# EAGLE design full_adder (EAGLE 9.6.0)

## Sheet 1 of 2
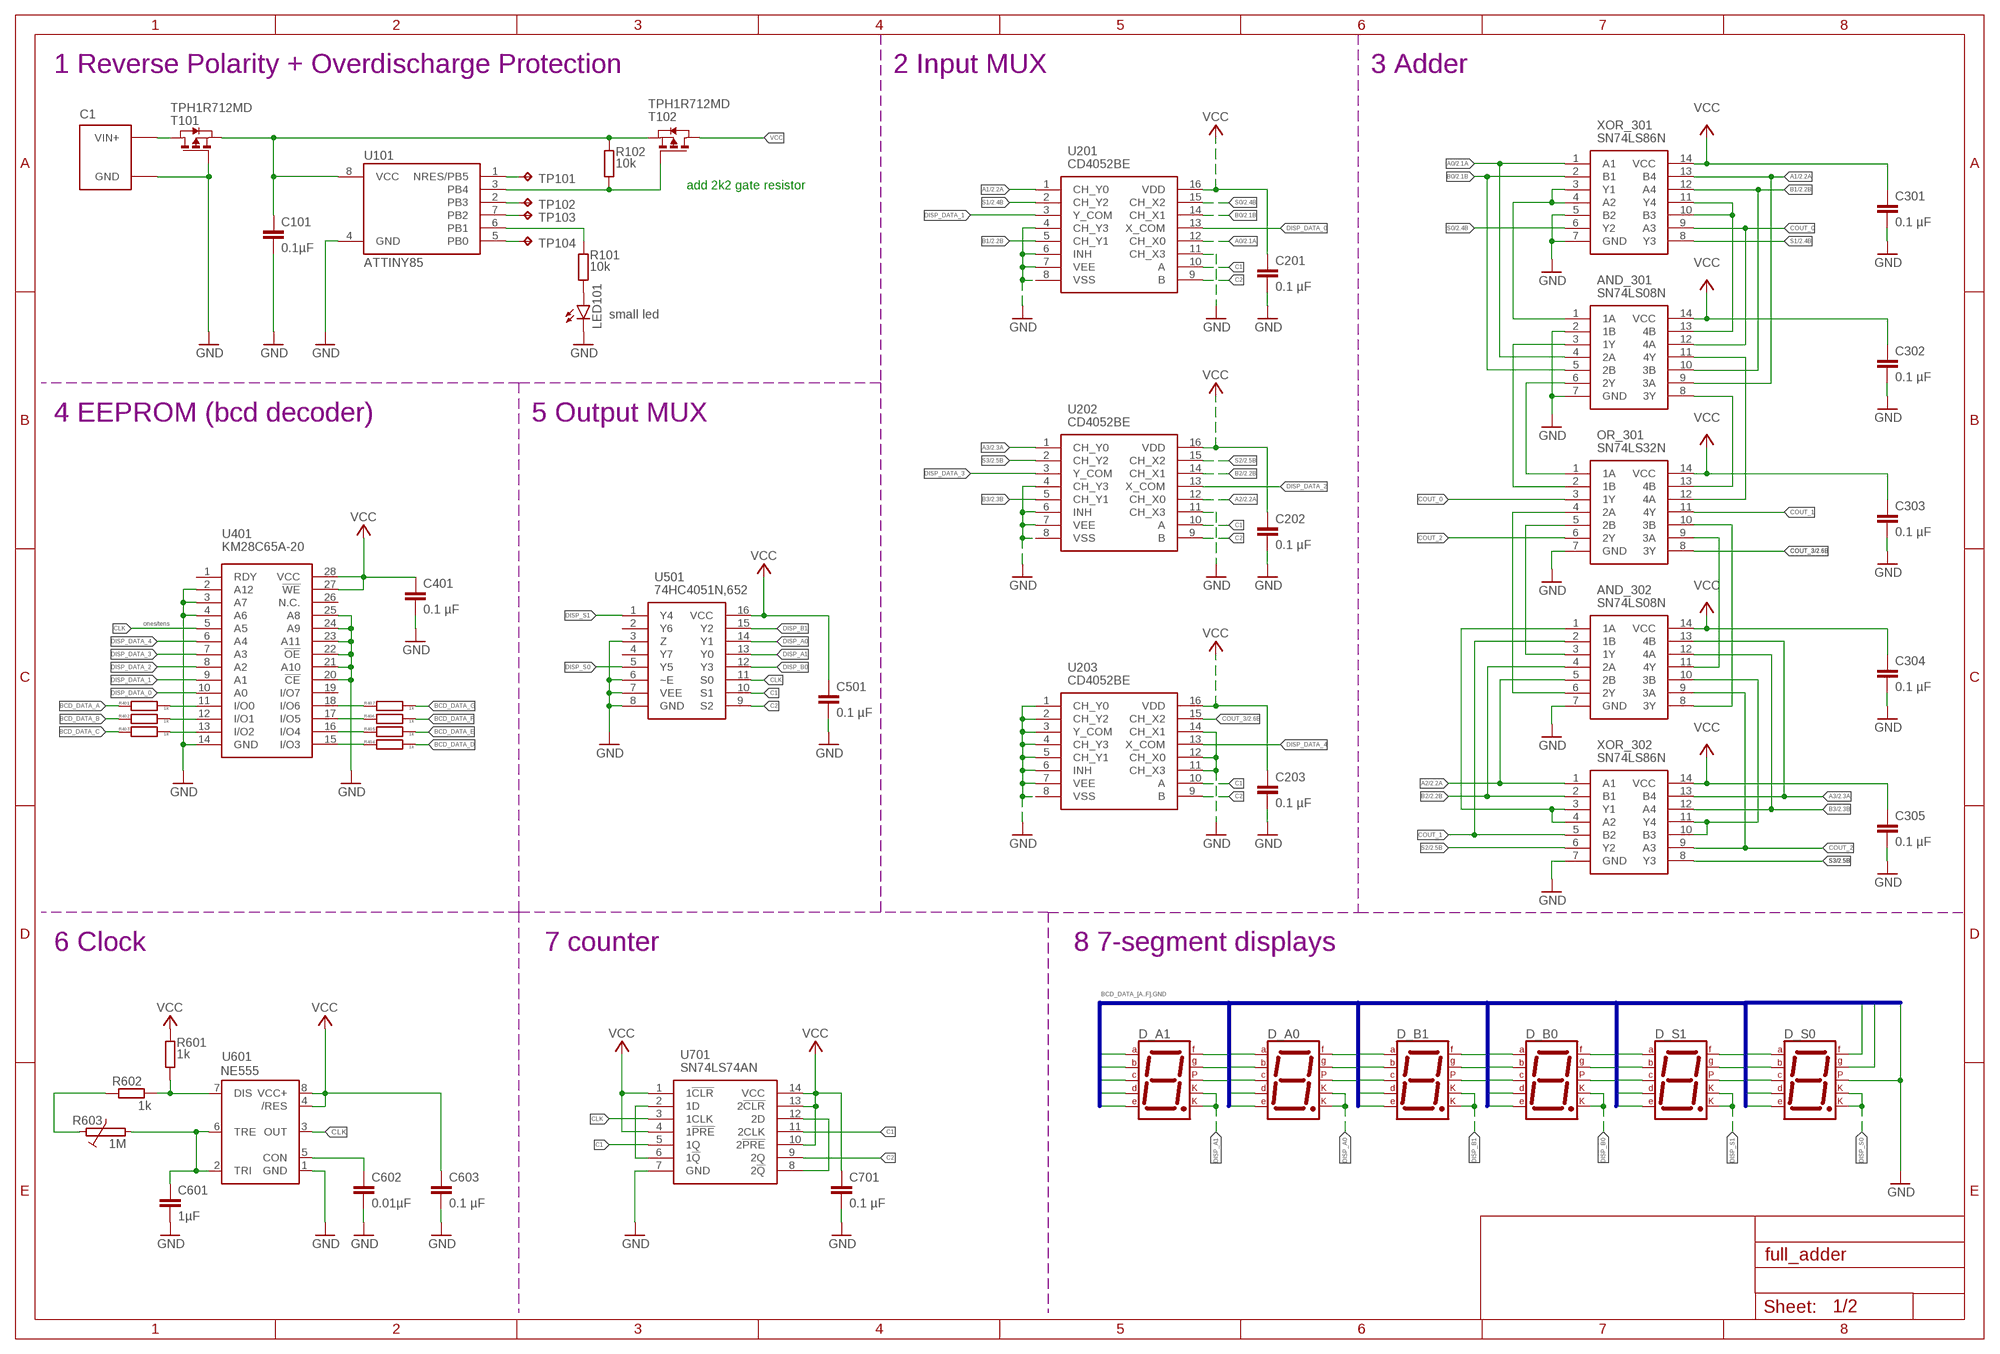
[diagram p0: schematic, sheet 1]

### Parts
AND_301  SN74LS08N  [DIP794W53P254L1930H508Q14N]
AND_302  SN74LS08N  [DIP794W53P254L1930H508Q14N]
C1  BATTERY_CONNECTOR  [BATTERY_CONNECTOR]
C101  0.1µF  C-EUC1206  [C1206]
C201  0.1 µF  C-EUC1206  [C1206]
C202  0.1 µF  C-EUC1206  [C1206]
C203  0.1 µF  C-EUC1206  [C1206]
C301  0.1 µF  C-EUC1206  [C1206]
C302  0.1 µF  C-EUC1206  [C1206]
C303  0.1 µF  C-EUC1206  [C1206]
C304  0.1 µF  C-EUC1206  [C1206]
C305  0.1 µF  C-EUC1206  [C1206]
C401  0.1 µF  C-EUC1206  [C1206]
C501  0.1 µF  C-EUC1206  [C1206]
C601  1µF  C-EU050-024X044  [C050-024X044]
C602  0.01µF  C-EU050-024X044  [C050-024X044]
C603  0.1 µF  C-EUC1206  [C1206]
C701  0.1 µF  C-EUC1206  [C1206]
D_A0  7SEG-CK  [7SEG-13]
D_A1  7SEG-CK  [7SEG-13]
D_B0  7SEG-CK  [7SEG-13]
D_B1  7SEG-CK  [7SEG-13]
D_S0  7SEG-CK  [7SEG-13]
D_S1  7SEG-CK  [7SEG-13]
LED101  LED3MM  [LED3MM]
OR_301  SN74LS32N  [DIP794W53P254L1930H508Q14N]
R101  10k  R-EU_R1206  [R1206]
R102  10k  R-EU_R1206  [R1206]
R401  1k  R-EU_R1206  [R1206]
R402  1k  R-EU_R1206  [R1206]
R403  1k  R-EU_R1206  [R1206]
R404  1k  R-EU_R1206  [R1206]
R405  1k  R-EU_R1206  [R1206]
R406  1k  R-EU_R1206  [R1206]
R407  1k  R-EU_R1206  [R1206]
R601  1k  R-EU_R1206  [R1206]
R602  1k  R-EU_R1206  [R1206]
R603  1M  POTENTIOMETER  [POTENTIOMETER]
T101  TPH1R712MD  [TPH1R712MDL1Q]
T102  TPH1R712MD  [TPH1R712MDL1Q]
TP101  TPB2,54  [B2,54]
TP102  TPB2,54  [B2,54]
TP103  TPB2,54  [B2,54]
TP104  TPB2,54  [B2,54]
U101  ATTINY85  ATTINY45-20P  [PDIP08_300MIL]
U201  CD4052BE  [DIP794W53P254L1930H508Q16N]
U202  CD4052BE  [DIP794W53P254L1930H508Q16N]
U203  CD4052BE  [DIP794W53P254L1930H508Q16N]
U401  KM28C65A-20  [KM28C65A-20]
U501  74HC4051N,652  [DIP254P762X420-16]
U601  NE555  [DIL-08]
U701  SN74LS74AN  [DIP794W53P254L1930H508Q14N]
XOR_301  SN74LS86N  [DIP762W53P254L1848H469Q14N]
XOR_302  SN74LS86N  [DIP762W53P254L1848H469Q14N]

### Nets
A0: AND_301.4(2A) U201.12(CH_X0) XOR_301.1(A1) ; also sheet 2
A1: AND_301.9(3A) U201.1(CH_Y0) XOR_301.13(B4) ; also sheet 2
A2: AND_302.5(2B) U202.12(CH_X0) XOR_302.1(A1) ; also sheet 2
A3: AND_302.13(4B) U202.1(CH_Y0) XOR_302.13(B4) ; also sheet 2
B0: AND_301.5(2B) U201.14(CH_X1) XOR_301.2(B1) ; also sheet 2
B1: AND_301.10(3B) U201.5(CH_Y1) XOR_301.12(A4) ; also sheet 2
B2: AND_302.4(2A) U202.14(CH_X1) XOR_302.2(B1) ; also sheet 2
B3: AND_302.12(4A) U202.5(CH_Y1) XOR_302.12(A4) ; also sheet 2
BCD_DATA_A: D_A0.7(A) D_A1.7(A) D_B0.7(A) D_B1.7(A) D_S0.7(A) D_S1.7(A) R401.1
BCD_DATA_B: D_A0.6(B) D_A1.6(B) D_B0.6(B) D_B1.6(B) D_S0.6(B) D_S1.6(B) R402.1
BCD_DATA_C: D_A0.4(C) D_A1.4(C) D_B0.4(C) D_B1.4(C) D_S0.4(C) D_S1.4(C) R403.1
BCD_DATA_D: D_A0.2(D) D_A1.2(D) D_B0.2(D) D_B1.2(D) D_S0.2(D) D_S1.2(D) R404.2
BCD_DATA_E: D_A0.1(E) D_A1.1(E) D_B0.1(E) D_B1.1(E) D_S0.1(E) D_S1.1(E) R405.2
BCD_DATA_F: D_A0.9(F) D_A1.9(F) D_B0.9(F) D_B1.9(F) D_S0.9(F) D_S1.9(F) R406.2
BCD_DATA_G: D_A0.10(G) D_A1.10(G) D_B0.10(G) D_B1.10(G) D_S0.10(G) D_S1.10(G) R407.2
C1: U201.10(A) U202.10(A) U203.10(A) U501.10(S1) U701.5(1Q) U701.11(2CLK)
C2: U201.9(B) U202.9(B) U203.9(B) U501.9(S2) U701.9(2Q)
CLK: U401.5(A5) U501.11(S0) U601.3(OUT) U701.3(1CLK)
COUT_0: AND_301.12(4A) OR_301.3(1Y) XOR_301.9(A3)
COUT_1: AND_302.2(1B) OR_301.11(4Y) XOR_302.5(B2)
COUT_2: AND_302.9(3A) OR_301.6(2Y) XOR_302.9(A3)
COUT_3: OR_301.8(3Y) U203.15(CH_X2) ; also sheet 2
DISP_A0: D_A0.3(CK1) D_A0.8(CK2) U501.14(Y1)
DISP_A1: D_A1.3(CK1) D_A1.8(CK2) U501.13(Y0)
DISP_B0: D_B0.3(CK1) D_B0.8(CK2) U501.12(Y3)
DISP_B1: D_B1.3(CK1) D_B1.8(CK2) U501.15(Y2)
DISP_DATA_0: U201.13(X_COM) U401.10(A0)
DISP_DATA_1: U201.3(Y_COM) U401.9(A1)
DISP_DATA_2: U202.13(X_COM) U401.8(A2)
DISP_DATA_3: U202.3(Y_COM) U401.7(A3)
DISP_DATA_4: U203.13(X_COM) U401.6(A4)
DISP_S0: D_S0.3(CK1) D_S0.8(CK2) U501.5(Y5)
DISP_S1: D_S1.3(CK1) D_S1.8(CK2) U501.1(Y4)
GND: AND_301.2(1B) AND_301.7(GND) AND_302.7(GND) C1.GND C101.2 C201.2 C202.2 C203.2 C301.2 C302.2 C303.2 C304.2 C305.2 C401.2 C501.2 C601.2 C602.2 C603.2 C701.2 D_A0.5(DP) D_A1.5(DP) D_B0.5(DP) D_B1.5(DP) D_S0.5(DP) D_S1.5(DP) LED101.K(C) OR_301.7(GND) T101.4(G) U101.4(GND) U201.4(CH_Y3) U201.6(INH) U201.7(VEE) U201.8(VSS) U201.11(CH_X3) U202.4(CH_Y3) U202.6(INH) U202.7(VEE) U202.8(VSS) U202.11(CH_X3) U203.1(CH_Y0) U203.2(CH_Y2) U203.3(Y_COM) U203.4(CH_Y3) U203.5(CH_Y1) U203.6(INH) U203.7(VEE) U203.8(VSS) U203.11(CH_X3) U203.12(CH_X0) U203.14(CH_X1) U401.2(A12) U401.3(A7) U401.4(A6) U401.14(GND) U401.20(!CE) U401.21(A10) U401.22(!OE) U401.23(A11) U401.24(A9) U401.25(A8) U501.3(Z) U501.6(~E) U501.7(VEE) U501.8(GND) U601.1(GND) U701.7(GND) XOR_301.5(B2) XOR_301.7(GND) XOR_302.7(GND) ; also sheet 2
N$1: AND_301.1(1A) XOR_301.3(Y1) XOR_301.4(A2)
N$2: AND_301.6(2Y) OR_301.1(1A)
N$3: AND_301.3(1Y) OR_301.2(1B)
N$4: AND_301.13(4B) XOR_301.10(B3) XOR_301.11(Y4)
N$5: AND_301.8(3Y) OR_301.13(4B)
N$6: AND_301.11(4Y) OR_301.12(4A)
N$7: AND_302.1(1A) XOR_302.3(Y1) XOR_302.4(A2)
N$8: AND_302.3(1Y) OR_301.5(2B)
N$9: AND_302.6(2Y) OR_301.4(2A)
N$10: AND_302.10(3B) XOR_302.10(B3) XOR_302.11(Y4)
N$11: C602.1 U601.5(CON)
N$12: AND_302.11(4Y) OR_301.9(3A)
N$13: AND_302.8(3Y) OR_301.10(3B)
N$14: C601.1 R603.POT$2 U601.2(TRI) U601.6(TRE)
N$15: R602.1 R603.POT$1
N$16: R601.1 R602.2 U601.7(DIS)
N$17: U701.8(2!Q) U701.12(2D)
N$30: R101.2 U101.6(PB1)
N$31: TP101.TP U101.1(NRES/PB5)
N$32: TP102.TP U101.2(PB3)
N$33: TP103.TP U101.7(PB2)
N$34: TP104.TP U101.5(PB0)
N$41: C1.VIN+ T101.5(D) T101.6(D) T101.7(D) T101.8(D) T101.9(D)
N$42: C101.1 R102.2 T101.1(S) T101.2(S) T101.3(S) T102.1(S) T102.2(S) T102.3(S) U101.8(VCC)
N$43: R102.1 T102.4(G) U101.3(PB4)
N$44: LED101.A R101.1
N$45: R401.2 U401.11(I/O0)
N$46: R402.2 U401.12(I/O1)
N$47: R403.2 U401.13(I/O2)
N$48: R407.1 U401.18(I/O6)
N$49: R406.1 U401.17(I/O5)
N$50: R405.1 U401.16(I/O4)
N$51: R404.1 U401.15(I/O3)
N$52: U701.2(1D) U701.6(1!Q)
S0: U201.15(CH_X2) XOR_301.6(Y2) ; also sheet 2
S1: U201.2(CH_Y2) XOR_301.8(Y3) ; also sheet 2
S2: U202.15(CH_X2) XOR_302.6(Y2) ; also sheet 2
S3: U202.2(CH_Y2) XOR_302.8(Y3) ; also sheet 2
VCC: AND_301.14(VCC) AND_302.14(VCC) C201.1 C202.1 C203.1 C301.1 C302.1 C303.1 C304.1 C305.1 C401.1 C501.1 C603.1 C701.1 OR_301.14(VCC) R601.2 T102.5(D) T102.6(D) T102.7(D) T102.8(D) T102.9(D) U201.16(VDD) U202.16(VDD) U203.16(VDD) U401.27(!WE) U401.28(VCC) U501.16(VCC) U601.4(/RES) U601.8(VCC+) U701.1(1!CLR) U701.4(1!PRE) U701.10(2!PRE) U701.13(2!CLR) U701.14(VCC) XOR_301.14(VCC) XOR_302.14(VCC) ; also sheet 2
Unconnected: U401.1(RDY) U401.19(I/O7) U401.26(N.C.) U501.2(Y6) U501.4(Y7)

### Buses
BCD_DATA_A,BCD_DATA_B,BCD_DATA_C,BCD_DATA_D,BCD_DATA_E,BCD_DATA_F,BCD_DATA_G,GND

### Notes on the sheet
- 1 Reverse Polarity + Overdischarge Protection | 2 Input MUX | 3 Adder
- add 2k2 gate resistor
- small led
- 4 EEPROM (bcd decoder) | 5 Output MUX
- ones/tens
- 6 Clock | 7 counter | 8 7-segment displays
- BCD_DATA_[A..F],GND

## Sheet 2 of 2
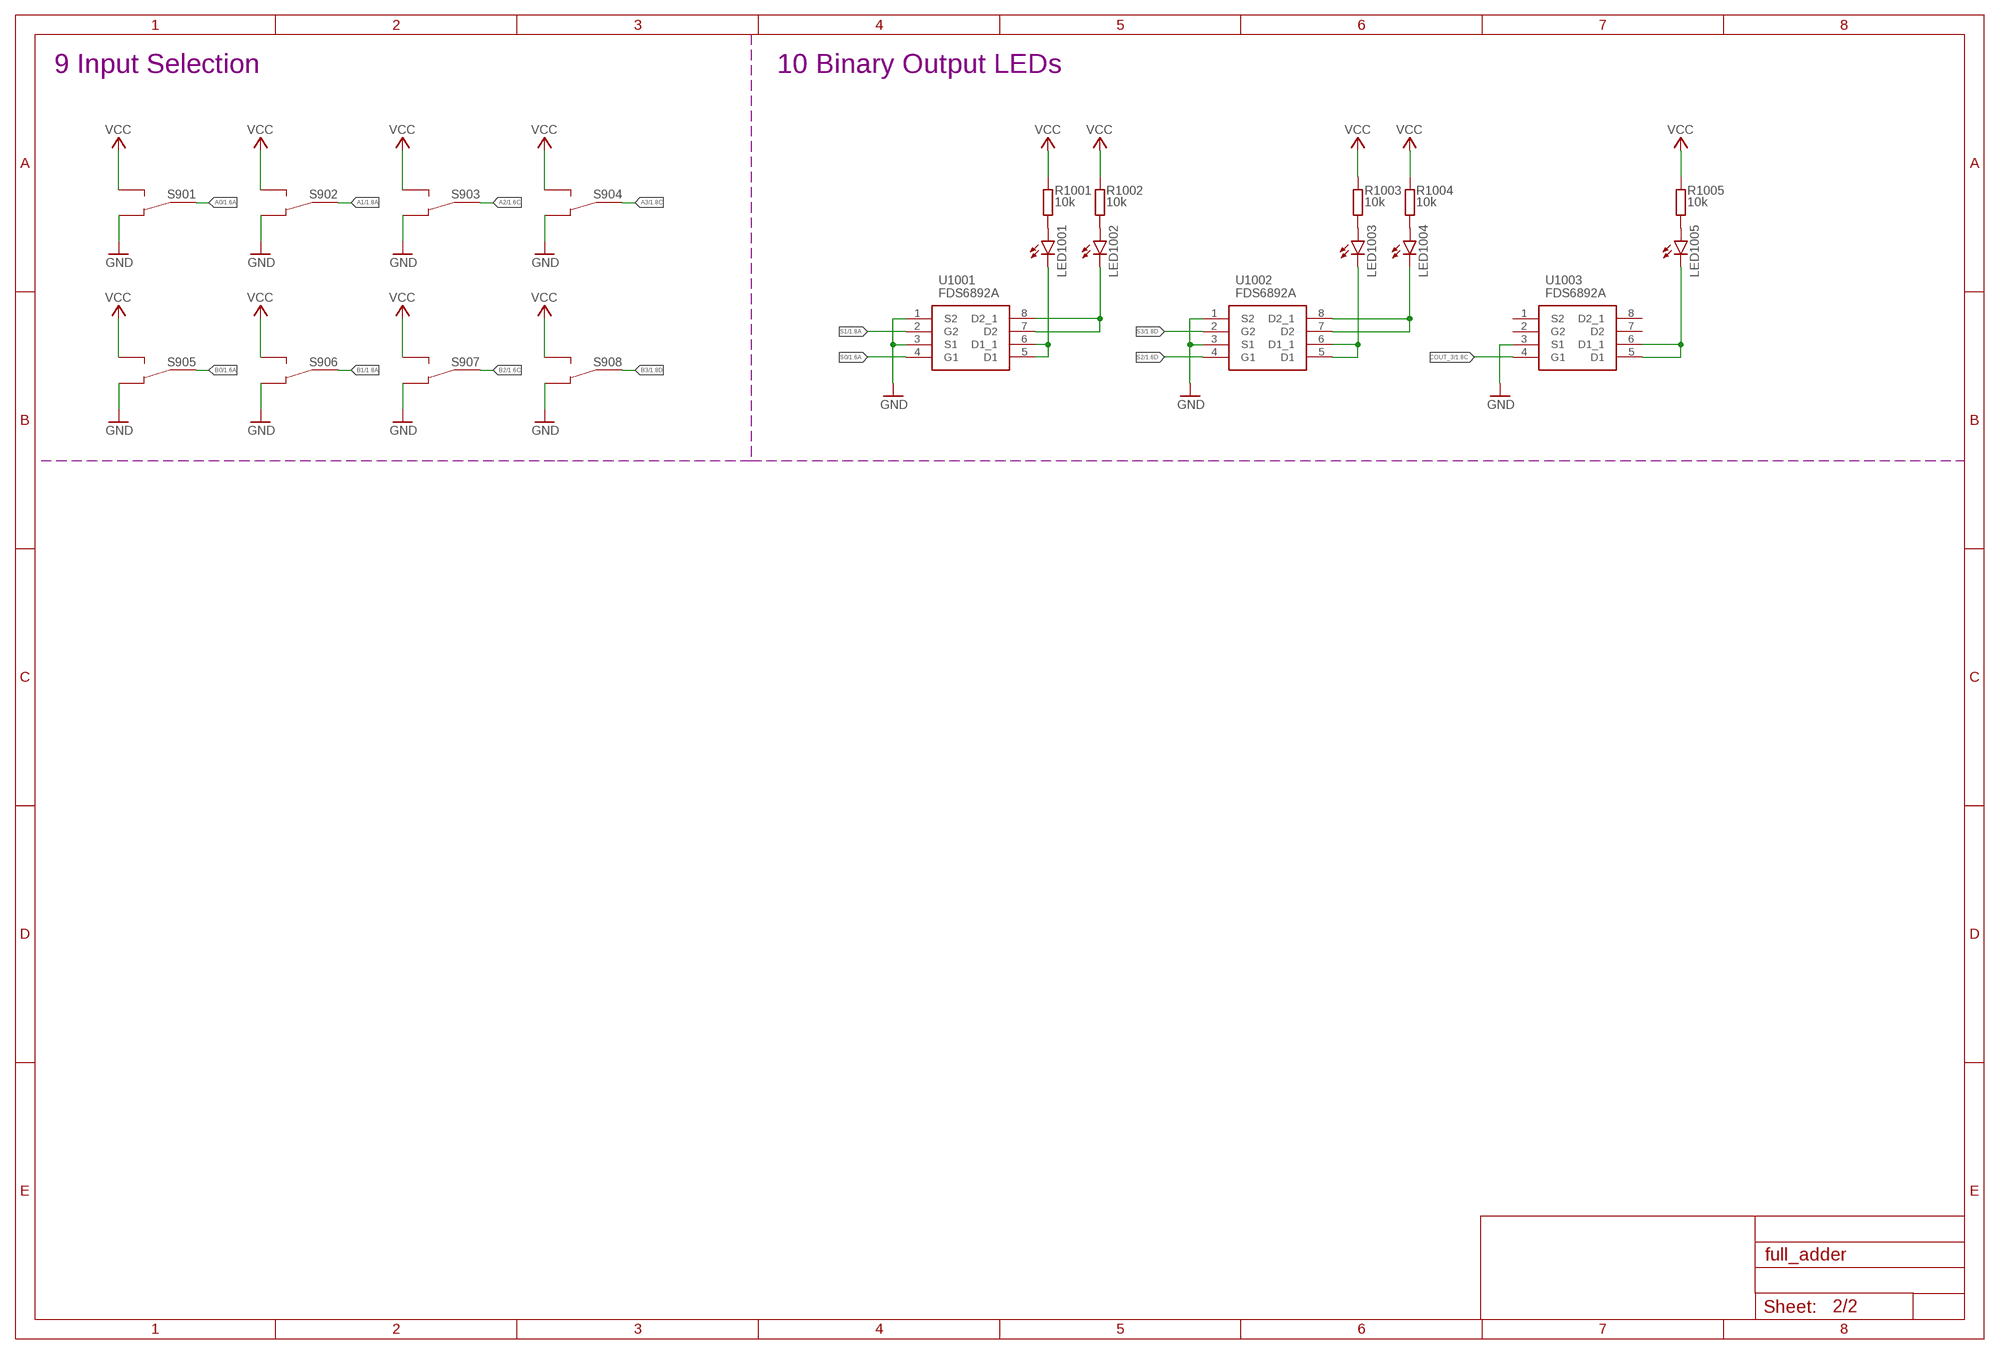
[diagram p1: schematic, sheet 2]

### Parts
LED1001  LED3MM  [LED3MM]
LED1002  LED3MM  [LED3MM]
LED1003  LED3MM  [LED3MM]
LED1004  LED3MM  [LED3MM]
LED1005  LED3MM  [LED3MM]
R1001  10k  R-EU_R1206  [R1206]
R1002  10k  R-EU_R1206  [R1206]
R1003  10k  R-EU_R1206  [R1206]
R1004  10k  R-EU_R1206  [R1206]
R1005  10k  R-EU_R1206  [R1206]
S901  TOGGLESWITCH  [TOGGLESWITCH]
S902  TOGGLESWITCH  [TOGGLESWITCH]
S903  TOGGLESWITCH  [TOGGLESWITCH]
S904  TOGGLESWITCH  [TOGGLESWITCH]
S905  TOGGLESWITCH  [TOGGLESWITCH]
S906  TOGGLESWITCH  [TOGGLESWITCH]
S907  TOGGLESWITCH  [TOGGLESWITCH]
S908  TOGGLESWITCH  [TOGGLESWITCH]
U1001  FDS6892A  [SOIC127P600X175-8N]
U1002  FDS6892A  [SOIC127P600X175-8N]
U1003  FDS6892A  [SOIC127P600X175-8N]

### Nets
A0: S901.OUT(P$X) ; also sheet 1
A1: S902.OUT(P$X) ; also sheet 1
A2: S903.OUT(P$X) ; also sheet 1
A3: S904.OUT(P$X) ; also sheet 1
B0: S905.OUT(P$X) ; also sheet 1
B1: S906.OUT(P$X) ; also sheet 1
B2: S907.OUT(P$X) ; also sheet 1
B3: S908.OUT(P$X) ; also sheet 1
COUT_3: U1003.4(G1) ; also sheet 1
GND: S901.GND(P$A) S902.GND(P$A) S903.GND(P$A) S904.GND(P$A) S905.GND(P$A) S906.GND(P$A) S907.GND(P$A) S908.GND(P$A) U1001.1(S2) U1001.3(S1) U1002.1(S2) U1002.3(S1) U1003.3(S1) ; also sheet 1
N$26: LED1001.A R1001.1
N$27: LED1002.A R1002.1
N$28: LED1003.A R1003.1
N$29: LED1004.A R1004.1
N$35: LED1005.A R1005.1
N$36: LED1001.K(C) U1001.5(D1) U1001.6(D1_1)
N$37: LED1002.K(C) U1001.7(D2) U1001.8(D2_1)
N$38: LED1003.K(C) U1002.5(D1) U1002.6(D1_1)
N$39: LED1005.K(C) U1003.5(D1) U1003.6(D1_1)
N$40: LED1004.K(C) U1002.7(D2) U1002.8(D2_1)
S0: U1001.4(G1) ; also sheet 1
S1: U1001.2(G2) ; also sheet 1
S2: U1002.4(G1) ; also sheet 1
S3: U1002.2(G2) ; also sheet 1
VCC: R1001.2 R1002.2 R1003.2 R1004.2 R1005.2 S901.VCC(P$B) S902.VCC(P$B) S903.VCC(P$B) S904.VCC(P$B) S905.VCC(P$B) S906.VCC(P$B) S907.VCC(P$B) S908.VCC(P$B) ; also sheet 1
Unconnected: U1003.1(S2) U1003.2(G2) U1003.7(D2) U1003.8(D2_1)

### Notes on the sheet
- 9 Input Selection | 10 Binary Output LEDs

## Library data of the parts
AND_301 AND_302 = SN74LS08N:SN74LS08N: Quad 2i/p AND gate,SN74LS08N DIP14 25pcs Source: Datasheet <http://componentsearchengine.com/Datasheets/3/SN74LS08N.pdf>; DESCRIPTION: Quad 2i/p AND gate,SN74LS08N DIP14 25pcs; HEIGHT: 5.08mm; MANUFACTURER_NAME: Texas Instruments; MANUFACTURER_PART_NUMBER: SN74LS08N; MOUSER_PART_NUMBER: 595-SN74LS08N; MOUSER_PRICE-STOCK: https://www.mouser.com/Search/Refine.aspx?Keyword=595-SN74LS08N; RS_PART_NUMBER: 0307519P; RS_PRICE-STOCK: http://uk.rs-online.com/web/p/products/0307519P
C1 = custom:BATTERY_CONNECTOR
C101 C201-C203 C301-C305 C401 C501 C601-C603 C701 = rcl:C-EU: CAPACITOR, European symbol; SPICEPREFIX: C
D_A0 D_A1 D_B0 D_B1 D_S0 D_S1 = special:7SEG-CK: 7-segment DISPLAY single cathode, 13 mm
LED101 LED1001-LED1005 = led:LED: LED OSRAM: - CHIPLED LG R971, LG N971, LY N971, LG Q971, LY Q971, LO R971, LY R971 LH N974, LH R974 LS Q976, LO Q976, LY Q976 LO Q996 - Hyper CHIPLED LW Q18S LB Q993, LB Q99A, LB R99A - SideLED LS A670, LO A670, LY A670, LG A670, LP A670 LB A673, LV A673, LT A673, LW A673 LH A674 LY A675 LS A676, LA A676, LO A676, LY A676, LW A676 LS A679, LY A679, LG A679 - Hyper Micro SIDELED® LS Y876, LA Y876, LO Y876, LY Y876 LT Y87S - SmartLED LW L88C, LW L88S LB L89C, LB L89S, LG L890 LS L89K, LO L89K, LY L89K LS L896, LA L896, LO L896, LY L896 - TOPLED LS T670, LO T670, LY T670, LG T670, LP T670 LSG T670, LSP T670, LSY T670, LOP T670, LYG T670 LG T671, LOG T671, LSG T671 LB T673, LV T673, LT T673, LW T673 LH T674 LS T676, LA T676, LO T676, LY T676, LB T676, LH T676, LSB T676, LW T676 LB T67C, LV T67C, LT T67C, LS T67K, LO T67K, LY T67K, LW E67C LS E67B, LA E67B, LO E67B, LY E67B, LB E67C, LV E67C, LT E67C LW T67C LS T679, LY T679, LG T679 LS T770, LO T770, LY T770, LG T770, LP T770 LB T773, LV T773, LT T773, LW T773 LH T774 LS E675, LA E675, LY E675, LS T675 LS T776, LA T776, LO T776, LY T776, LB T776 LHGB T686 LT T68C, LB T68C - Hyper Mini TOPLED® LB M676 - Mini TOPLED Santana® LG M470 LS M47K, LO M47K, LY M47K Source: http://www.osram.convergy.de LUXEON: - LUMILED® LXK2-PW12-R00, LXK2-PW12-S00, LXK2-PW14-U00, LXK2-PW14-V00 LXK2-PM12-R00, LXK2-PM12-S00, LXK2-PM14-U00 LXK2-PE12-Q00, LXK2-PE12-R00, LXK2-PE12-S00, LXK2-PE14-T00, LXK2-PE14-U00 LXK2-PB12-K00, LXK2-PB12-L00, LXK2-PB12-M00, LXK2-PB14-N00, LXK2-PB14-P00, LXK2-PB14-Q00 LXK2-PR12-L00, LXK2-PR12-M00, LXK2-PR14-Q00, LXK2-PR14-R00 LXK2-PD12-Q00, LXK2-PD12-R00, LXK2-PD12-S00 LXK2-PH12-R00, LXK2-PH12-S00 LXK2-PL12-P00, LXK2-PL12-Q00, LXK2-PL12-R00 Source: www.luxeon.com KINGBRIGHT: KA-3528ASYC Source: www.kingbright.com
OR_301 = SN74LS32N:SN74LS32N: Quad 2i/p OR gate,SN74LS32N DIP14 25pcs Source: Datasheet <http://componentsearchengine.com/Datasheets/3/SN74LS32N.pdf>; DESCRIPTION: Quad 2i/p OR gate,SN74LS32N DIP14 25pcs; HEIGHT: 5.08mm; MANUFACTURER_NAME: Texas Instruments; MANUFACTURER_PART_NUMBER: SN74LS32N; MOUSER_PART_NUMBER: 595-SN74LS32N; MOUSER_PRICE-STOCK: https://www.mouser.com/Search/Refine.aspx?Keyword=595-SN74LS32N; RS_PART_NUMBER: 0307569P; RS_PRICE-STOCK: http://uk.rs-online.com/web/p/products/0307569P
R101 R102 R401-R407 R601 R602 R1001-R1005 = rcl:R-EU_: RESISTOR, European symbol; SPICEPREFIX: R
R603 = custom:POTENTIOMETER
S901-S908 = custom:TOGGLESWITCH
T101 T102 = SamacSys_Parts:TPH1R712MD: Silicon P-Channel enhancement type MOS
TP101-TP104 = testpad:TP: Test pad
U101 = _hhn_attiny25_45_85:ATTINY45*: ATMEL ATtiny 45 Packages: P = PDIP 08 30mil S = SOIC 08 EIAJ 208mil X = TSSOP 08 4.4mm Technologies Note: for complete ordering code (temp. range, finish, tape&reel etc.) see www.atmel.com • Supply Voltage: V = (1.8…5.5)V | [blank] = (2.7…5.5)V • Speed: 10 = 10 MHz | 20 = 20 MHz Author: Dipl.-Ing. FH Rainer Bayer HHN Hochschule Heilbronn (Heilbronn University), rainer.bayer@hs-heilbronn.de Ingenieurbüro ing-rb, mail@ing-rb.de
U201-U203 = CD4052BE:CD4052BE: CMOS Differential 4-Channel Analog Multiplexer/Demultiplexer with Logic-Level Conversion Source: Datasheet <http://www.ti.com/lit/gpn/cd4052b>; DESCRIPTION: CMOS Differential 4-Channel Analog Multiplexer/Demultiplexer with Logic-Level Conversion; HEIGHT: 5.08mm; MANUFACTURER_NAME: Texas Instruments; MANUFACTURER_PART_NUMBER: CD4052BE; MOUSER_PART_NUMBER: 595-CD4052BE; MOUSER_PRICE-STOCK: https://www.mouser.co.uk/ProductDetail/Texas-Instruments/CD4052BE?qs=Tv815z3GeNSSxm5loQgO7w%3D%3D; RS_PART_NUMBER: 5036105; RS_PRICE-STOCK: https://uk.rs-online.com/web/p/products/5036105
U401 = custom:KM28C65A-20: 8 kBit EEPROM
U501 = SamacSys_Parts:74HC4051N,652: 8-channel analog multiplexer/demultiplexer Source: Datasheet; DESCRIPTION: 8-channel analog multiplexer/demultiplexer; HEIGHT: mm; MANUFACTURER_NAME: Nexperia; MANUFACTURER_PART_NUMBER: 74HC4051N,652
U601 = st-microelectronics_555_timer:NE555: General purpose bipolar Timer; MF: Arrow Electronics; MPN: NE555N; OC_FARNELL: 1467742; OC_NEWARK: 89K1486
U701 = SN74LS74AN:SN74LS74AN: Dual D-type pos.-edge-triggered flip-flops with preset and clear Source: Datasheet <http://www.ti.com/lit/gpn/sn74ls74a>; DESCRIPTION: Dual D-type pos.-edge-triggered flip-flops with preset and clear; HEIGHT: 5.08mm; MANUFACTURER_NAME: Texas Instruments; MANUFACTURER_PART_NUMBER: SN74LS74AN; MOUSER_PART_NUMBER: 595-SN74LS74AN; MOUSER_PRICE-STOCK: https://www.mouser.co.uk/ProductDetail/Texas-Instruments/SN74LS74AN?qs=b0gIXGU74fP41yYZQO4%252BKQ%3D%3D; RS_PART_NUMBER: 0307597P; RS_PRICE-STOCK: http://uk.rs-online.com/web/p/products/0307597P
U1001-U1003 = SamacSys_Parts:FDS6892A: FDS6892A, Dual N-channel MOSFET Transistor 7.5A 20V, 8-Pin SOIC Source: Datasheet; DESCRIPTION: FDS6892A, Dual N-channel MOSFET Transistor 7.5A 20V, 8-Pin SOIC; HEIGHT: 1.75mm; MANUFACTURER_NAME: ON Semiconductor; MANUFACTURER_PART_NUMBER: FDS6892A; MOUSER_PART_NUMBER: 512-FDS6892A; MOUSER_PRICE-STOCK: https://www.mouser.com/Search/Refine.aspx?Keyword=512-FDS6892A
XOR_301 XOR_302 = SN74LS86N:SN74LS86N: IC, Logic, 7400, Gate, SN74LS86N Source: Datasheet <https://docs-emea.rs-online.com/webdocs/0029/0900766b800296c4.pdf>; DESCRIPTION: IC, Logic, 7400, Gate, SN74LS86N; HEIGHT: 4.69mm; MANUFACTURER_NAME: ON Semiconductor; MANUFACTURER_PART_NUMBER: SN74LS86N; RS_PART_NUMBER: 0644234; RS_PRICE-STOCK: http://uk.rs-online.com/web/p/products/0644234

## Board
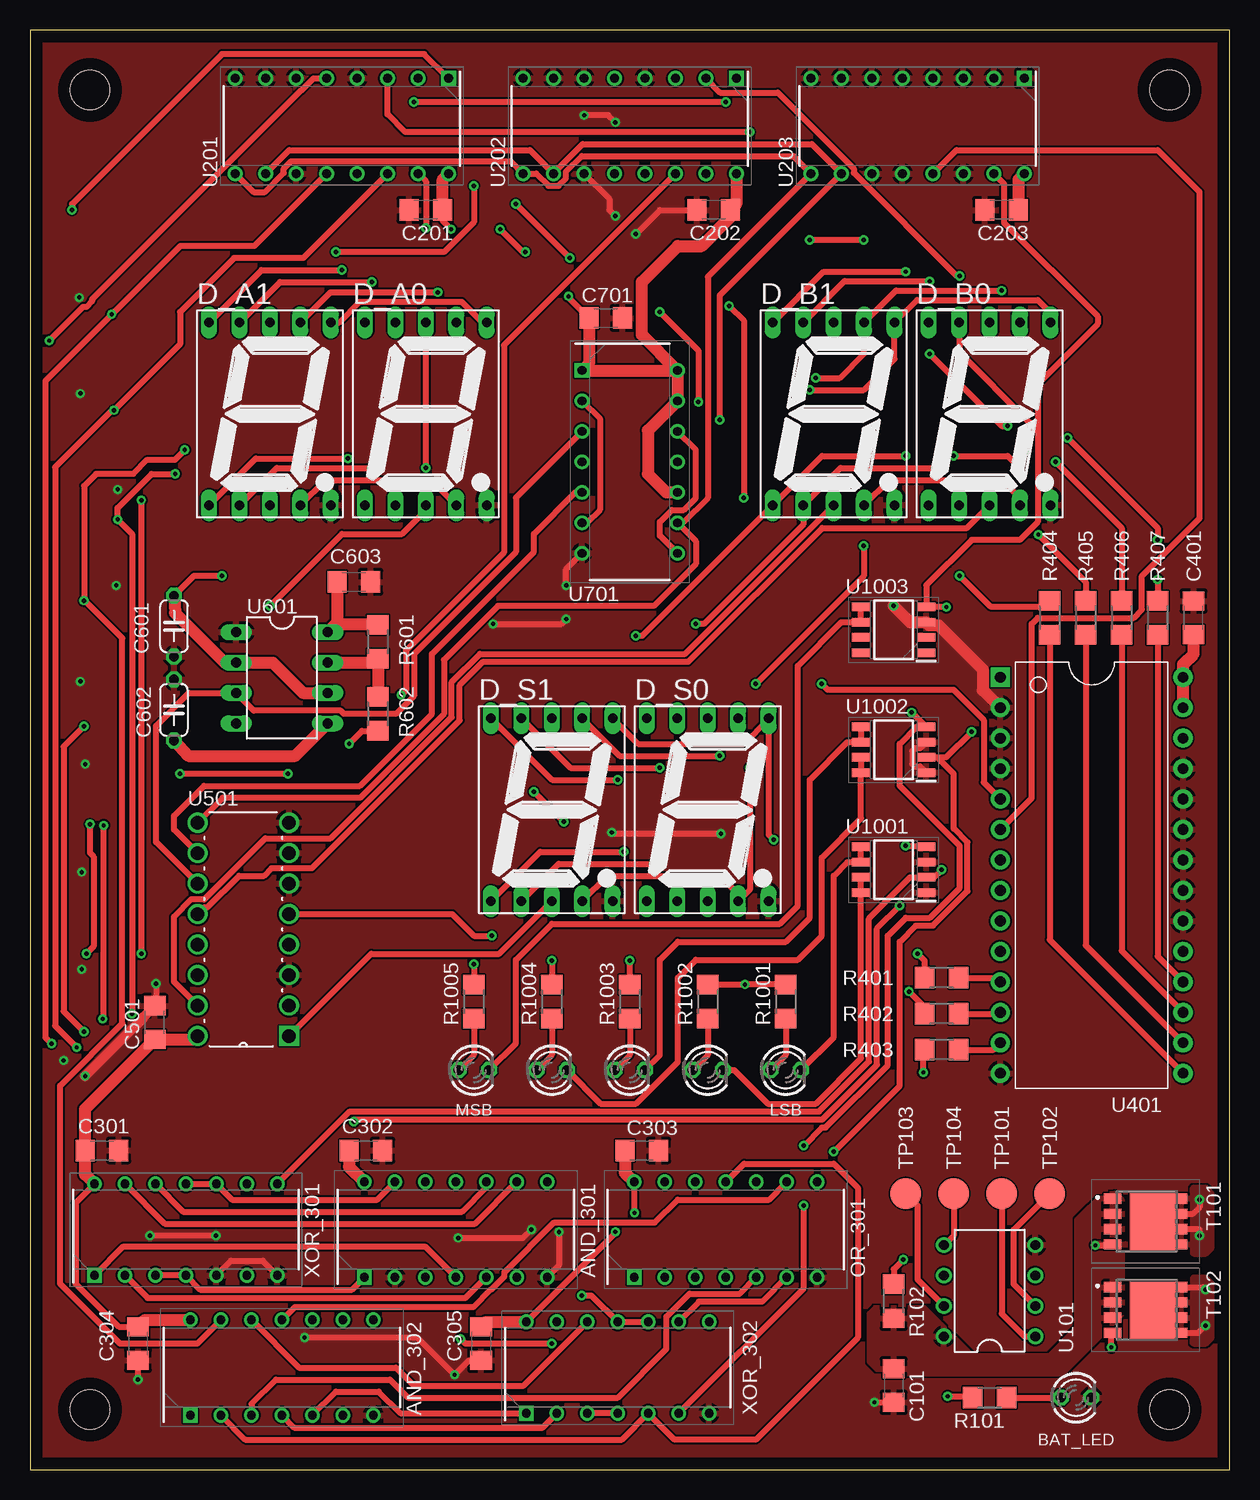
[diagram p2: board, top side]
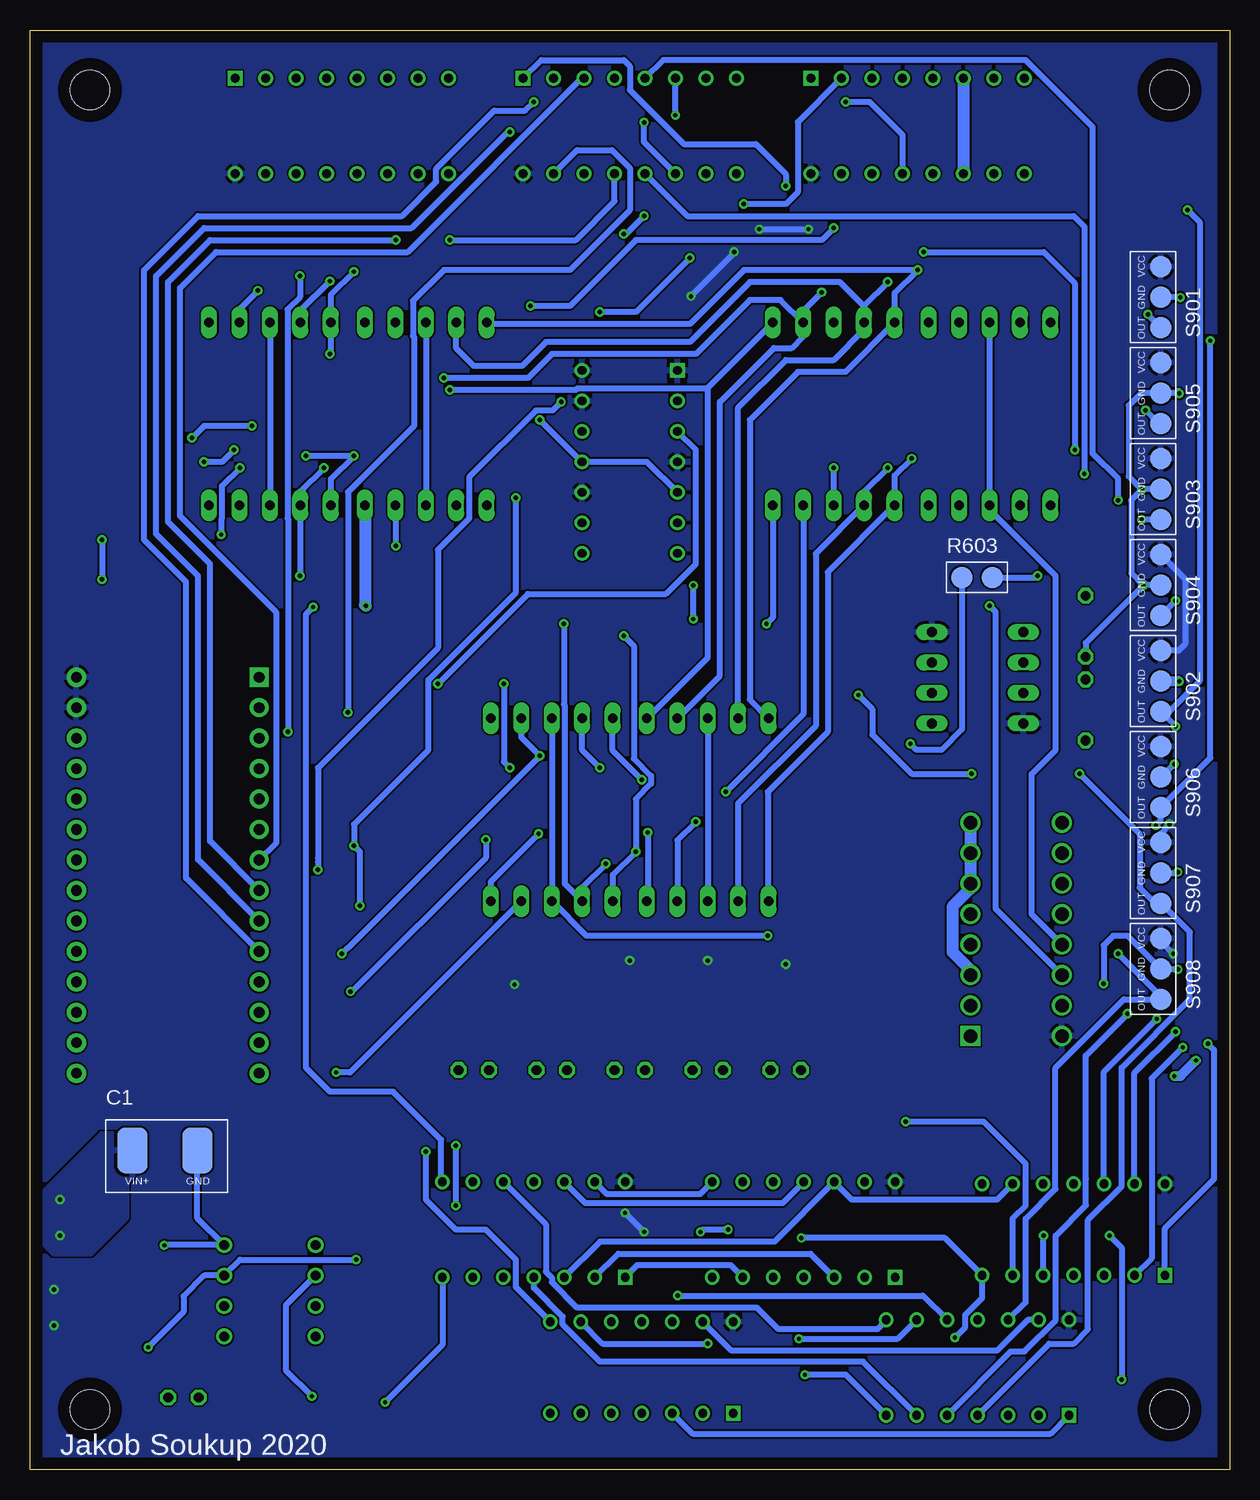
[diagram p3: board, bottom side, seen from below]

Size 100 x 120 mm. Coordinates in mm from the lower left corner, seen from the top.
Outline: 0,0 100,0 100,120 0,120 0,0
Copper layers (1*16): Top 0.035mm / dielectric 1.5mm / Bottom 0.035mm
Design rules "default *": minimum track width 6mil, minimum drill 0.35mm, track to track 6mil, track to pad 6mil, pad to pad 6mil, via to via 6mil, smd to smd 6mil, copper to edge 40mil, drill to drill 6mil, minimum pad ring 10mil, minimum via ring 8mil, stop-mask expansion 4mil, vias tented up to drill 0mil, thermal gap 10mil
Holes 3.3 mm at 5,115 95,115 95,5 5,5

### Footprints (pad centres in the part's own frame; a part is rotated, then mirrored left to right if it is on the bottom)
DIP794W53P254L1930H508Q14N = drill 0.73 pad 1.13 square: 1 -3.97,7.62 | drill 0.73 pad 1.13: 2 -3.97,5.08; 3 -3.97,2.54; 4 -3.97,0; 5 -3.97,-2.54; 6 -3.97,-5.08; 7 -3.97,-7.62; 8 3.97,-7.62; 9 3.97,-5.08; 10 3.97,-2.54; 11 3.97,0; 12 3.97,2.54; 13 3.97,5.08; 14 3.97,7.62
BATTERY_CONNECTOR = smd 2.54 x 3.81: GND 5.08,0; VIN+ -0.321,0
C1206 = smd 1.6 x 1.8: 1 -1.4,0; 2 1.4,0
C050-024X044 = drill 0.813 octagon: 1 -2.54,0; 2 2.54,0
7SEG-13 = drill 0.813 long: 1 -5.08,-7.62; 2 -2.54,-7.62; 3 0,-7.62; 4 2.54,-7.62; 5 5.08,-7.62; 6 5.08,7.62; 7 2.54,7.62; 8 0,7.62; 9 -2.54,7.62; 10 -5.08,7.62
LED3MM = drill 0.813 octagon: A -1.27,0; K 1.27,0
R1206 = smd 1.6 x 1.803: 1 -1.422,0; 2 1.422,0
POTENTIOMETER = smd 1.778 x 1.778: POT$1 -1.27,1.27; POT$2 1.27,1.27
TOGGLESWITCH = smd 1.778 x 1.778: GND 1.27,1.27; OUT 3.81,1.27; VCC -1.27,1.27
TPH1R712MDL1Q = smd 0.85 x 1.45: 1 -1.905,-2.75; 2 -0.635,-2.75; 3 0.635,-2.75; 4 1.905,-2.75 | smd 0.85 x 1.05: 5 1.905,2.95; 6 0.635,2.95; 7 -0.635,2.95; 8 -1.905,2.95 | smd 4.7 x 3.75: 9 0,0.55
B2,54 = smd 2.54 x 2.54: TP 0,0
PDIP08_300MIL = drill 0.813: 1 -3.81,-3.81; 2 -1.27,-3.81; 3 1.27,-3.81; 4 3.81,-3.81; 5 3.81,3.81; 6 1.27,3.81; 7 -1.27,3.81; 8 -3.81,3.81
DIP794W53P254L1930H508Q16N = drill 0.73 pad 1.13 square: 1 -3.97,8.89 | drill 0.73 pad 1.13: 2 -3.97,6.35; 3 -3.97,3.81; 4 -3.97,1.27; 5 -3.97,-1.27; 6 -3.97,-3.81; 7 -3.97,-6.35; 8 -3.97,-8.89; 9 3.97,-8.89; 10 3.97,-6.35; 11 3.97,-3.81; 12 3.97,-1.27; 13 3.97,1.27; 14 3.97,3.81; 15 3.97,6.35; 16 3.97,8.89
KM28C65A-20 = drill 0.889 pad 1.6 square: 1 -82.55,8.89 | drill 0.889 pad 1.6: 2 -80.01,8.89; 3 -77.47,8.89; 4 -74.93,8.89; 5 -72.39,8.89; 6 -69.85,8.89; 7 -67.31,8.89; 8 -64.77,8.89; 9 -62.23,8.89; 10 -59.69,8.89; 11 -57.15,8.89; 12 -54.61,8.89; 13 -52.07,8.89; 14 -49.53,8.89; 15 -49.53,24.13; 16 -52.07,24.13; 17 -54.61,24.13; 18 -57.15,24.13; 19 -59.69,24.13; 20 -62.23,24.13; 21 -64.77,24.13; 22 -67.31,24.13; 23 -69.85,24.13; 24 -72.39,24.13; 25 -74.93,24.13; 26 -77.47,24.13; 27 -80.01,24.13; 28 -82.55,24.13
DIP254P762X420-16 = drill 1.118 pad 1.676 square: 1 -7.62,17.78 | drill 1.118 pad 1.676: 2 -7.62,15.24; 3 -7.62,12.7; 4 -7.62,10.16; 5 -7.62,7.62; 6 -7.62,5.08; 7 -7.62,2.54; 8 -7.62,0; 9 0,0; 10 0,2.54; 11 0,5.08; 12 0,7.62; 13 0,10.16; 14 0,12.7; 15 0,15.24; 16 0,17.78
DIL-08 = drill 0.813 long: 1 -3.81,-3.81; 2 -1.27,-3.81; 3 1.27,-3.81; 4 3.81,-3.81; 5 3.81,3.81; 6 1.27,3.81; 7 -1.27,3.81; 8 -3.81,3.81
SOIC127P600X175-8N = smd 1.525 x 0.7: 1 -2.712,1.905; 2 -2.712,0.635; 3 -2.712,-0.635; 4 -2.712,-1.905; 5 2.712,-1.905; 6 2.712,-0.635; 7 2.712,0.635; 8 2.712,1.905
DIP762W53P254L1848H469Q14N = drill 0.73 pad 1.13 square: 1 -3.81,7.62 | drill 0.73 pad 1.13: 2 -3.81,5.08; 3 -3.81,2.54; 4 -3.81,0; 5 -3.81,-2.54; 6 -3.81,-5.08; 7 -3.81,-7.62; 8 3.81,-7.62; 9 3.81,-5.08; 10 3.81,-2.54; 11 3.81,0; 12 3.81,2.54; 13 3.81,5.08; 14 3.81,7.62

### Placement (x,y rotation side)
AND_301  35.5,20 90 top
AND_302  21,8.5 90 top
C1  91.13,26.59 0 bottom
C101  72,7 270 top
C201  33,105 180 top
C202  57,105 180 top
C203  81,105 180 top
C301  6,26.6 0 top
C302  28,26.6 0 top
C303  51,26.6 0 top
C304  9,10.5 270 top
C305  37.6,10.5 270 top
C401  97,71 90 top
C501  10.4,37.26 90 top
C601  12,70.3 270 top
C602  12,63.32 90 top
C603  27,74 0 top
C701  48,96 0 top
D_A0  33,88 0 top
D_A1  20,88 0 top
D_B0  80,88 0 top
D_B1  67,88 0 top
D_S0  56.5,55 0 top
D_S1  43.5,55 0 top
LED101  87.21,6 0 top
LED1001  63,33.3 0 top
LED1002  56.5,33.3 0 top
LED1003  50,33.3 0 top
LED1004  43.5,33.3 0 top
LED1005  37,33.3 0 top
OR_301  58,20 90 top
R101  80,6 180 top
R102  72,14.03 270 top
R401  76,41 0 top
R402  76,38 0 top
R403  76,35 0 top
R404  85,71 90 top
R405  88,71 90 top
R406  91,71 90 top
R407  94,71 90 top
R601  29,69 90 top
R602  29,63 90 top
R603  21.06,73.09 0 bottom
R1001  63,39 90 top
R1002  56.5,39 90 top
R1003  50,39 90 top
R1004  43.5,39 90 top
R1005  37,39 90 top
S901  7,99 270 bottom
S902  7,67 270 bottom
S903  7,83 270 bottom
S904  7,75 270 bottom
S905  7,91 270 bottom
S906  7,59 270 bottom
S907  7,51 270 bottom
S908  7,43 270 bottom
T101  93,20.68 270 top
T102  93,13.3 270 top
TP101  81,23 0 top
TP102  85,23 0 top
TP103  73,23 0 top
TP104  77,23 0 top
U101  80,14.9 90 top
U201  26,112 270 top
U202  50,112 270 top
U203  74,112 270 top
U401  72,-16.5 270 top
U501  13.97,53.92 180 top
U601  21,66 270 top
U701  50,84 0 top
U1001  72,50 180 top
U1002  72,60 180 top
U1003  72,70 180 top
XOR_301  13,20 90 top
XOR_302  49,8.5 90 top

### Tracks (layer width: path | path; a pad name or v marks a point on that pad's centre or on a via)
A0  (via drill 0.35)
  Top 0.508: XOR_301.1 7.79,18.6 32.93,18.6 AND_301.4 | v1.8,35.5 1.3,36 1.3,90.76 6.8,96.26 v6.8,96.3 7.06,96.56 7.1,96.56 12.54,102 18.7,102 U201.12
  Bottom 0.508: XOR_301.1 5.38,20.12 1.3,24.2 1.3,35 v1.8,35.5 | v6.8,96.3 6.8,96.26 S901.OUT
A1  (via drill 0.35)
  Top 0.508: XOR_301.13 11.23,20.5 37.11,20.5 AND_301.9 | v4.5,36.5 2.8,38.2 2.8,60.26 v4.5,61.96 | U201.1 32.86,118 16,118 3.5,105.5 v3.5,105
  Bottom 0.508: XOR_301.13 7.92,33.08 v4.5,36.5 | v3.5,105 2.5,104 2.5,65.72 5.03,63.19 S902.OUT v4.5,61.96
A2  (via drill 0.35)
  Top 0.508: AND_302.5 25.51,6.5 29.07,6.5 30.88,4.69 XOR_302.1 | v12.1,83 10.14,83 7.3,80.16 v7.3,79.2 8.5,78 v8.5,38
  Bottom 0.508: AND_302.5 18.23,9.84 17.1,9.84 14.5,12.44 14.5,19.5 11.97,22.02 11.97,24.23 12,24.26 12,34.5 v8.5,38 | U202.12 45.2,104.5 13,104.5 12.1,103.6 v12.1,83 | S903.OUT v7.29,79.19 v7.3,79.2
A3  (via drill 0.35)
  Top 0.508: AND_302.13 13.95,10.5 7.5,10.5 2.5,15.5 2.5,32 7.7,37.2 7.7,69.3 4.58,72.42 v4.5,72.42 4.5,82 5.5,83 8.61,83 9.79,84.19 12.09,84.19 v12.9,85 | v37,107 37,104 34.5,101.5 v25.5,101.5
  Bottom 0.508: AND_302.13 16.82,12.47 19.39,9.9 41.51,9.9 XOR_302.13 | U202.1 57.36,117.5 50.5,117.5 50,117 50,115 45.5,110.5 39.5,110.5 37,108 v37,107 | v25.5,101.5 15.5,101.5 12.9,98.9 v12.9,85 | v4.5,72.42 S904.OUT
B0  (via drill 0.35)
  Top 0.508: XOR_301.2 9.81,14.3 36.31,14.3 AND_301.5 | v3.9,35.2 2.1,37 2.1,83.56 6.84,88.3 v7,88.3 12.5,93.8 12.5,96.5 17,101 22.78,101 U201.14
  Bottom 0.508: XOR_301.2 6.5,17.61 6.5,32.6 v3.9,35.2 | v7,88.3 5.89,87.19 S905.OUT
B1  (via drill 0.35)
  Top 0.508: XOR_301.12 12.77,21.5 36,21.5 38.04,23.54 AND_301.10 | v6.05,37.55 6.16,37.66 v6.16,53.69 | v1.6,94.1 4.42,96.92 4.72,96.92 5.18,97.38 5.18,97.56 22.57,114.94 22.61,114.94 23.64,115.97 U201.5
  Bottom 0.508: XOR_301.12 10.46,33.15 v6.05,37.55 | v6.16,53.69 5.73,54.11 S906.OUT 1.6,59.32 v1.6,94.1
B2  (via drill 0.35)
  Top 0.508: AND_302.4 22.03,3.5 42.73,3.5 XOR_302.2 | U202.14 39.5,93.72 39.5,76.43 31.34,68.27 31.34,64.95 v30.95,64.56 | v21.5,58 v12.5,58
  Bottom 0.508: AND_302.4 15.03,10.5 13,10.5 11.8,11.7 11.8,20.8 9,23.6 9,33.5 3.3,39.2 3.3,44.8 5.69,47.19 S907.OUT 6.19,47.19 7.5,48.5 7.5,53 v12.5,58 | v30.95,64.56 29.79,63.39 29.79,61.25 29.32,60.79 29.29,60.79 26.5,58 v21.5,58
B3  (via drill 0.35)
  Top 0.508: AND_302.12 22.43,8.5 30.5,8.5 32,7 41.15,7 XOR_302.12 | v9.29,80.8 v9.29,43
  Bottom 0.508: AND_302.12 17,13.93 17,20.9 14.52,23.39 14.52,33.48 8.81,39.19 S908.OUT 5.73,39.45 v9.29,43 | U202.5 47.2,117.5 17,117.5 11.4,111.9 11.4,84.7 9.29,82.58 v9.29,80.8
BCD_DATA_A  (via drill 0.35)
  Top 0.508: D_A1.7 25.05,98.13 v34,98.13 | v81,98.28 72.2,98.28 D_B1.7 69.54,93.04 67.5,91 v65.5,91 | D_S1.7 49.16,59.5 v57.5,59.5 | v74,43 74.58,42.42 R401.1
  Bottom 0.508: v34,98.13 35.54,96.59 D_A0.7 | v81,98.28 82.54,96.75 D_B0.7 | D_S0.7 59.04,61.04 v57.5,59.5 73.5,43.5 73.58,43.42 v74,43 | D_S1.7 42.5,66.16 42.5,89 38,93.5 36.5,93.5 35.54,94.46 D_A0.7 | D_A0.7 37.42,97.5 40,97.5 44.5,93 56.5,93 58.5,91 v65.5,91
BCD_DATA_B  (via drill 0.35)
  Top 0.508: D_A1.6 25.75,95.62 27.48,97.35 35.98,97.35 37.71,95.62 D_A0.6 | D_B0.6 85.08,96.42 84,97.5 73.96,97.5 D_B1.6 72.08,92.58 69.5,90 v65,90 | D_S1.6 50.7,60.5 59.5,60.5 61.58,62.58 D_S0.6 61.58,52.92 v62,52.5 | v73.28,39.84 74.58,38.55 R402.1
  Bottom 0.508: D_S1.6 43.5,67.7 43.5,90.2 | D_A0.6 43.5,90.2 | v65,90 54.5,90 54.4,90.11 43.59,90.11 43.5,90.2 | v62,52.5 62,51 73.16,39.84 v73.28,39.84
BCD_DATA_C  (via drill 0.35)
  Top 0.508: D_A1.4 24.66,82.5 33.42,82.5 D_A0.4 | D_B1.4 71.66,82.5 81,82.5 82.54,80.96 D_B0.4 | D_S1.4 48.16,49.5 57.5,49.5 59.04,47.96 D_S0.4 60,48.34 v60,58.5 | v42,56.5 v44.5,54 | v69.5,77 69.5,74.5 v60.5,65.5 | v74.48,33.1 74.48,34.9 R403.1
  Bottom 0.508: D_A0.4 35.54,62.96 v42,56.5 | v44.5,54 46.04,52.46 D_S1.4 | D_S0.4 73.32,33.1 v74.48,33.1 | v60.5,65.5 60.5,59 v60,58.5 | v69.5,77 69.5,80.34 D_B1.4
BCD_DATA_D  (via drill 0.35)
  Top 0.508: D_A1.2 20.58,83.5 v28.5,83.5 | v75.5,83.5 67.58,83.5 D_B1.2 64.46,78.77 56.19,70.5 v55.5,70.5 | D_S1.2 44.08,50.5 v52,50.5 | v77.5,74.5 80.06,71.94 84.37,71.94 84.92,72.5 R404.2
  Bottom 0.508: v28.5,83.5 30.46,81.54 D_A0.2 34.5,76.34 34.5,62 40.96,55.54 D_S1.2 | v75.5,83.5 77.46,81.54 D_B0.2 77.5,80.34 v77.5,74.5 | v52,50.5 53.96,48.54 D_S0.2 55.43,48.85 55.43,63.72 55.5,63.79 v55.5,70.5
BCD_DATA_E  (via drill 0.35)
  Top 0.508: D_A1.1 18.82,84.28 v26.5,84.28 | v73,84.5 66.04,84.5 D_B1.1 51.04,69.5 v50.5,69.5 | D_S1.1 42.54,51.5 v49.5,51.5 | v77,84.5 81.5,84.5 v82.5,83.5 | v84.06,77.94 88,74 R405.2
  Bottom 0.508: v26.5,84.28 27.92,82.86 D_A0.1 33.5,74.8 33.5,61.5 38.5,56.5 38.5,47.46 D_S1.1 | D_B0.1 74.92,82.58 v73,84.5 v77,84.5 | D_S0.1 51.42,49.58 v49.5,51.5 49.5,55.89 48.22,57.17 48.22,57.83 49.65,59.26 49.65,68.65 v50.5,69.5 | v84.06,77.94 84.06,79.24 84.01,79.28 84.01,81.99 v82.5,83.5
BCD_DATA_F  (via drill 0.35)
  Top 0.508: D_A1.9 20.84,99 v28.5,99 | D_B1.9 67.91,99.07 v75,99.07 | D_S1.9 45.08,58.5 v52.5,58.5 | D_B0.9 77.46,93.15 83.28,87.33 83.28,86.67 83,86.39 v83,85 | v85.5,84 91,78.5 R406.2
  Bottom 0.508: v28.5,99 30.46,97.04 D_A0.9 | v75,99.07 77.46,96.61 D_B0.9 | v52.5,58.5 53.96,59.96 D_S0.9 | D_S1.9 40.96,88.54 37,92.5 33,92.5 30.46,95.04 D_A0.9 | D_A0.9 30.46,96.96 32.5,99 40,99 45,94 57,94 59,92 63,92 64.46,93.46 D_B1.9 | v83,85 84,84 v85.5,84
BCD_DATA_G  (via drill 0.35)
  Top 0.508: D_A1.10 19.3,100 v26,100 | D_B1.10 66.15,99.85 v73,99.85 | D_S1.10 43.54,57.5 v49,57.5 | v86.5,86 94,78.5 v94,77.5 | v75,93 81,87 v81.5,87 | v94,74.2 R407.2
  Bottom 0.508: v73,99.85 74.92,97.93 D_B0.10 74.92,93.08 v75,93 | v49,57.5 51.42,59.92 D_S0.10 | D_S1.10 40,64.2 40,87.5 36,91.5 32.04,91.5 D_A0.10 27.92,98.08 v26,100 40.5,100 45,95.5 61.8,95.5 D_B1.10 | v81.5,87 85.5,87 v86.5,86 | v94,77.5 v94,74.2
C1  (via drill 0.35)
  Top 0.508: U501.10 12,53.35 12,54.5 14.5,57 27.5,57 33.5,63 33.5,68 42,76.5 42,78 45.46,81.46 U701.5 | U201.10 21.62,110 41.68,110 U202.10 44.02,108.39 44.02,108.45 46.07,110.5 65.18,110.5 U203.10 57.5,97.88 v57.5,87.5
  Bottom 0.508: U701.5 48.57,84 U701.11 57.47,87.5 v57.5,87.5
C2
  Top 0.508: U501.9 16.05,56 27.5,56 34.5,63 34.5,67.5 39,72 52,72 55.5,75.5 55.5,77.39 U701.9 54.42,78.92 56.5,81 56.5,99.42 U203.9 63.64,109.5 46,109.5 44.67,108.17 44.67,107.61 44.08,107 43.23,107 42.2,108.03 U202.9 40.09,109.06 21.77,109.06 21.16,108.45 21.16,108.09 19.57,106.5 18.64,106.5 U201.9
CLK  (via drill 0.35)
  Top 0.508: U701.3 40.5,81.01 40.5,76.5 32,68 32,64.5 30.5,63 26.17,63 25.91,63.26 18.66,63.26 U601.3 13.23,64.73 10.5,62 10.5,52.31 U501.11 | U401.5 79.5,57.28 79.5,62.5 77,65 66.5,65 v66,65.5
  Bottom 0.508: U701.3 44.5,85.01 44.5,75.5 47,73 58.5,73 v66,65.5
COUT_0
  Bottom 0.508: OR_301.3 52.49,19 37.93,19 AND_301.12 31.49,22.5 19.39,22.5 XOR_301.9
COUT_1
  Top 0.508: OR_301.11 59.53,25.5 67,25.5 69,23.5 69,11 60.5,2.5 53.73,2.5 XOR_302.5 49.35,2.5 17.95,2.5 AND_302.2
COUT_2  (via drill 0.35)
  Top 0.508: OR_301.6 61.05,14 55.77,14 XOR_302.9 | v43.5,10.5 36.3,10.5 v35.9,10.9
  Bottom 0.508: XOR_302.9 52.27,10.5 v43.5,10.5 | v35.9,10.9 27.65,10.9 AND_302.9
COUT_3  (via drill 0.35)
  Top 0.508: U203.15 81.19,107.19 81.19,103.93 89,96.12 89,95.5 84,90.5 84,79 82.5,77.5 78.5,77.5 74.71,73.71 U1003.4 v76.39,71.91 v76.4,71.9
  Bottom 0.508: OR_301.8 65.72,24.07 65.72,27.5 69.72,31.5 75,31.5 77,33.5 77,71.3 v76.4,71.9
DISP_A0  (via drill 0.35)
  Top 0.508: v20,72 26,78 31,78 33,80 D_A0.3 | v33,83.5 D_A0.8
  Bottom 0.508: U501.14 19.5,46.75 19.5,71.5 v20,72 | D_A0.3 v33,83.5
DISP_A1
  Bottom 0.508: U501.13 16.5,46.29 16.5,58 14.5,60 14.5,74.5 20,80 D_A1.3 D_A1.8
DISP_B0
  Top 0.508: U501.12 14.53,46.85 14.79,46.85 17.43,49.5 19.5,49.5 20.14,50.13 23.5,50.13 35.82,62.45 35.82,65.39 37.77,67.34 54.89,67.34 66.05,78.5 78.12,78.5 D_B0.3
  Bottom 0.508: D_B0.8 D_B0.3
DISP_B1
  Top 0.508: D_B1.3 54.62,68 37.5,68 35.16,65.66 35.16,62.73 25.06,52.62 19.62,52.62 14.52,47.52 14.49,47.55 13.45,47.55 12,46.09 12,40.65 U501.15
  Bottom 0.508: D_B1.8 D_B1.3
DISP_DATA_0  (via drill 0.35)
  Top 0.508: v58,114 v32,114
  Bottom 0.508: U401.10 87,49.3 87,74 90.5,77.5 90.5,100 86,104.5 69,104.5 66.14,107.36 66.14,108.45 61.31,113.28 58.72,113.28 v58,114 | U201.13 27.27,111.27 30,114 v32,114
DISP_DATA_1  (via drill 0.35)
  Top 0.508: U201.3 29.81,112.97 31.28,111.5 v60,111.5
  Bottom 0.508: U401.9 86,50.84 86,74.5 89.5,78 89.5,99.5 85.5,103.5 68.19,103.5 60.19,111.5 v60,111.5
DISP_DATA_2  (via drill 0.35)
  Top 0.508: v69.5,102.5 v65,102.5
  Bottom 0.508: U401.8 85,52.38 85,75.5 88.5,79 88.5,99 85,102.5 v69.5,102.5 | v65,102.5 54.5,102.5 51.27,105.73 U202.13
DISP_DATA_3
  Bottom 0.508: U202.3 54.03,115.97 68.5,101.5 84.5,101.5 87.5,98.5 87.5,79.5 79.5,71.5 79.5,52.2 U401.7
DISP_DATA_4
  Top 0.508: U203.13 77.24,110 94,110 97.5,106.5 97.5,79.3 92.69,74.49 92.69,71.69 92,71 84,71 83.5,70.5 83.5,55.96 U401.6
DISP_S0  (via drill 0.35)
  Top 0.508: U501.5 35.2,46.3 37,44.5 v38.5,44.5
  Bottom 0.508: v38.5,44.5 53.62,44.5 D_S0.3 D_S0.8
DISP_S1
  Top 0.508: U501.1 28.45,43 39.12,43 D_S1.3
  Bottom 0.508: D_S1.8 D_S1.3
GND  (via drill 0.35)
  Top 0.508: v10.5,40.5 10.5,38.76 C501.2 | C305.2 36.6,9.1 v35.4,7.9 32.3,11 v22.9,11 | v38.6,70.5 44.3,70.5 v44.7,70.9 | v44.7,73.7 44.7,75.05 U701.7 | U1002.3 74.2,60.12 73.78,60.12 73.54,59.88 73.54,58.85 73.78,58.61 74.2,58.61 U1002.1 | v88.8,18.7 90.17,18.7 T101.4 | v48.8,112.3 48.2,112.9 v46.2,112.9 | U202.11 48.3,105.92 48.3,105 v48.8,104.5 | v50.5,103 52.5,105 C202.2 | v15.5,19.5 v10,19.5 | v9,7.5 C304.2 | XOR_301.5 16.75,17.4 19.41,17.4 XOR_301.7 | v70.4,5.6 C101.2 | v57.6,53 48.6,53 v48.5,53.1 | v35.7,19.3 41.1,19.3 v41.8,20 | v44.1,19.8 44.1,17.01 AND_301.7
  Top 0.813: C501.2 9.44,37.7 9.44,37.61 8.89,37.06 8.86,37.06 v4.6,32.8
  Top 1.016: v72,72 73.36,70.64 U1003.3 74.97,70.38 75.75,70.38 79.43,66.69 79.43,64.98 U401.2
  Bottom 0.508: S906.GND 5.67,57.73 v4.6,58.8 | S907.GND 4.37,49.73 v4.3,49.8 | v4.3,41.7 4.33,41.73 S908.GND 8.5,44.5 9.7,44.5 10.5,43.7 v10.5,40.5 | AND_302.7 31.99,7.9 v35.4,7.9 | v7.2,73.7 12,68.9 C601.2 | D_A0.5 38.08,71.02 v38.6,70.5 | v44.7,70.9 v44.7,73.7 | C1.GND 86.05,20.95 U101.4 v88.79,18.71 v88.8,18.7 | U202.11 48.8,110.64 v48.8,112.3 | v46.2,112.9 v46.19,112.91 U202.6 | v48.8,104.5 50.3,103 v50.5,103 | XOR_301.5 15.54,19.46 v15.5,19.5 | v10,19.5 9,18.5 v9,7.5 | OR_301.7 65.62,10.38 v70.4,5.6 | D_S0.5 61.58,49.02 v57.6,53 | v48.5,53.1 48.5,47.46 D_S1.5 | v22.9,11 22.02,11.88 22.02,12.89 20.62,14.3 XOR_301.7 23.73,19.3 v35.7,19.3 | v41.8,20 43.9,20 v44.1,19.8 | S904.GND 7.17,73.73 8.2,74.76 8.2,80.8 v7.3,81.7 | 4.23,89.73 S905.GND 7.37,89.73 8.4,88.7 8.4,82.8 v7.3,81.7 | S903.GND 7.27,81.73 v7.3,81.7 | v4.1,97.7 4.13,97.73 S901.GND
  Bottom 0.813: v4.6,32.8 4.1,32.8 v2.8,34.1 | 4.23,89.73 v4.2,89.7 | 7.17,73.73 v7.2,73.7 | S902.GND 4.23,65.73 v4.2,65.7
  Bottom 1.016: D_B1.5 72.08,72.08 v72,72 | U501.8 U501.7 U501.6 21.59,48.42 23.09,46.92 23.09,43.14 21.59,41.64 U501.3 | U201.6 U201.11
  pour Top (rank 2): 0,120 100,120 100,0 0,0
N$1
  Top 0.508: XOR_301.3 XOR_301.4 14.19,15 26.85,15 AND_301.1
N$2
  Bottom 0.508: OR_301.1 49.35,17.05 41.6,17.05 AND_301.6
N$3
  Bottom 0.508: OR_301.2 50.95,18 34.93,18 AND_301.3
N$4
  Top 0.508: XOR_301.11 XOR_301.10 16.85,22.5 28.95,22.5 AND_301.13
N$5
  Bottom 0.508: AND_301.8 44.15,22.95 51.9,22.95 OR_301.13
N$6
  Bottom 0.508: AND_301.11 37.27,22.2 53.69,22.2 OR_301.12
N$7
  Top 0.508: XOR_302.4 XOR_302.3
  Bottom 0.508: XOR_302.3 44.77,3 14.91,3 AND_302.1
N$8
  Top 0.508: OR_301.5 59.17,14.66 54.98,14.66 53.05,12.73 53.05,10.05 49,6 31.5,6 30,7.5 20.5,7.5 18.46,5.46 AND_302.3
N$9
  Bottom 0.508: AND_302.6 30.55,9 52.5,9 55.59,12.1 55.59,12.73 58,15.14 OR_301.4
N$10  (via drill 0.35)
  Top 0.508: XOR_302.10 XOR_302.11 46.81,14.5 v46,14.5
  Bottom 0.508: v46,14.5 25.57,14.5 AND_302.10
N$11
  Top 1.016: C602.1 13.19,59.5 22.12,59.5 U601.5
N$12
  Top 0.508: OR_301.9 61.61,22.5 54,22.5 52.1,20.6 43.7,20.6 39.55,16.45 39.55,16.09 38.47,15.01 38.41,15.01 36.96,13.56 22.09,13.56 AND_302.11
N$13
  Bottom 0.508: OR_301.10 57,20.43 57,16.5 56.48,15.98 56.48,15.61 54.38,13.5 39.4,13.5 37.6,11.7 29.35,11.7 28.62,12.43 AND_302.8
N$14  (via drill 0.35)
  Top 0.508: v16,74.5 13.66,74.5 C601.1
  Top 1.016: C601.1 12.09,71.41 16.23,67.27 U601.2 20.23,67.27 22.77,64.73 U601.6
  Bottom 0.508: R603.POT$2 16.14,74.36 v16,74.5
N$15  (via drill 0.35)
  Top 0.508: v26.6,60.5 27.68,61.58 R602.1
  Bottom 0.508: R603.POT$1 22.33,61.67 24,60 26.1,60 v26.6,60.5
N$16
  Top 1.016: U601.7 28.69,67.27 R601.1 R602.2
N$17
  Top 0.508: U701.8 52.5,77.85 52.5,79 53.5,80 54.5,80 55.5,81 55.5,85.01 U701.12
N$26
  Top 0.508: R1001.1 63,34.57 LED1001.A
N$27
  Top 0.508: R1002.1 56.5,34.57 LED1002.A
N$28
  Top 0.508: R1003.1 50,34.57 LED1003.A
N$29
  Top 0.508: R1004.1 43.5,34.57 LED1004.A
N$30  (via drill 0.35)
  Top 0.508: v76.5,6.1 78.48,6.1 R101.2
  Bottom 0.508: U101.6 78.68,13.68 78.68,8.28 v76.5,6.1
N$31
  Top 0.508: TP101.TP 81,13 82.91,11.09 U101.1
N$32
  Top 0.508: U101.2 82,15.44 82,20 TP102.TP
N$33
  Top 0.508: U101.7 74,15.82 74,22 TP103.TP
N$34
  Top 0.508: TP104.TP 77,19.52 U101.5
N$35
  Top 0.508: R1005.1 37,34.57 LED1005.A
N$36
  Top 0.508: LED1001.K 67,36.03 67,49.5 68.14,50.63 U1001.6 U1001.5
N$37
  Top 0.508: LED1002.K 58.7,33.3 61.5,30.5 65.5,30.5 69.29,34.29 U1001.8 U1001.7
N$38
  Top 0.508: U1002.5 U1002.6 68.14,60.63 65,57.5 65,46 63,44 54,44 52.5,42.5 52.5,34.53 LED1003.K
N$39
  Top 0.508: LED1005.K 40.5,35.53 40.5,42.5 43.5,45.5 62.5,45.5 64,47 64,67 67.64,70.64 U1003.6 U1003.5
N$40
  Top 0.508: U1002.7 U1002.8 69.29,54.29 66,51 66,44.5 64,42.5 55.5,42.5 54,41 54,34 50.5,30.5 47.57,30.5 LED1004.K
N$41  (via drill 0.35)
  Top 0.508: T101.7 96.95,21.32 97.5,21.86 v97.5,22.5 | v97.5,19.5 97.5,20 97.45,20.05 T101.6 95.91,20 94.23,20 T101.9
  pour Top: 97,23.5 96,22.5 96,19 97,18 98,18 98.5,18.5 98.5,22.5 98.5,23 98,23.5
  pour Bottom: 91,25 92,24 92,23 92,21 95,18 98,18 99,19 99,23 94,28 92,28 91,27 91,26
N$42
  pour Top: 70.5,13.5 74.5,13.5 78.5,9.5 85,9.5 87.3,11.8 87.3,20.8 89.5,23 90.5,23 91,22.5 91,13 86,8 71,8 70,9 70,13
N$43  (via drill 0.35)
  Top 0.508: v72.8,17.5 72,16.7 R102.1 | v90.15,10.2 90.15,11.29 T102.4
  Bottom 0.508: v72.8,17.5 82.48,17.5 U101.3 85.47,16.17 87.2,14.45 87.2,13.14 v90.15,10.2
N$44
  Top 0.508: R101.1 LED101.A
N$45
  Top 0.508: R401.2 80.54,41 U401.11
N$46
  Top 0.508: R402.2 80.78,38 U401.12
N$47
  Top 0.508: R403.2 80.32,35 U401.13
N$48
  Top 0.508: R407.1 94,42.78 U401.18
N$49
  Top 0.508: R406.1 91,43.24 U401.17
N$50
  Top 0.508: R405.1 88,43.7 U401.16
N$51
  Top 0.508: R404.1 85,44.16 U401.15
N$52
  Top 0.508: U701.2 47.5,87.61 47.5,80 46.42,78.92 U701.6
S0  (via drill 0.35)
  Top 0.508: v27,29 27.18,29.18 66.05,29.18 70.61,33.74 70.61,45.11 v72.5,47 | U201.15 33,107.38 v33,103.5 | v58.28,97 59.5,95.78 v59.5,81 | U1001.4 74.62,52 v73,52
  Bottom 0.508: XOR_301.6 18.08,20.92 17,22 17,25.5 20.5,29 v27,29 | v33,103.5 34,102.5 49.5,102.5 55,97 v58.28,97 | v59.5,81 59.5,73.11 66.78,65.83 66.78,60 73,53.78 v73,52 72.5,51.5 v72.5,47
S1  (via drill 0.35)
  Top 0.508: XOR_301.8 26.65,29.84 65.77,29.84 69.95,34.01 69.95,45.95 73.36,49.37 U1001.2 75.36,49.37 v76,50 | v40.5,105.5 v45,101 | v52.5,96.5 55.72,93.28 v55.72,89
  Bottom 0.508: U201.2 36,112.32 36,106.5 37,105.5 v40.5,105.5 | v45,101 49.5,96.5 v52.5,96.5 | v55.72,89 56.43,88.28 57.83,88.28 63.39,82.72 63.39,79.28 66,76.67 66,68.5 76,58.5 76,51 76,50.65 v76,50
S2  (via drill 0.35)
  Top 0.508: XOR_302.6 64.5,15.11 v64.5,22 | v64.5,27 66.02,28.52 66.32,28.52 71.5,33.7 71.5,44.5 73,46 75,46 77.5,48.5 77.5,52 72.5,57 72.5,60.5 73.91,61.91 U1002.4 v73.5,63.12
  Bottom 0.508: v64.5,22 v64.5,27 | U202.15 54.38,110 51.5,110 50,108.5 50,105 55,100 65.5,100 68.07,97.43 68.07,94.52 68,94.45 68,87 73.5,81.5 v73.5,63.12
S3  (via drill 0.35)
  Top 0.508: v67,26.5 72.5,32 72.5,44 73.84,45.34 75.27,45.34 78.16,48.23 78.16,52.27 77,53.43 77,58 75.64,59.37 U1002.2 76.36,59.37 v78.5,61.5 | U202.2 57.53,114.78 62.35,114.78 68.67,108.45 68.67,108.09 77.27,99.5 v77.5,99.5
  Bottom 0.508: XOR_302.8 59.5,15.19 59.5,17.5 62,20 64.5,20 67,22.5 v67,26.5 | v77.5,99.5 77.5,97.75 78.53,96.72 78.53,79.28 78.5,79.25 v78.5,61.5
VCC  (via drill 0.35)
  Top 0.508: v98,12 97.39,11.39 T102.5 95.45,11.39 T102.9 | T102.8 97.8,15.21 v98,15 | R1003.2 v50,42.42 | v43.5,42.42 R1004.2 | v37,42.12 R1005.2 | R1002.2 v59.6,40.42 R1001.2 | XOR_301.14 3.8,22.23 3.8,15.5 7.4,11.9 C304.1 | C701.1 44.9,97.7 v44.9,97.8 | v41.3,101.5 41.1,101.5 v39.2,103.4 | v35.1,103.4 34.4,104.1 C201.1 | XOR_302.14 48.8,19.73 v48.8,19.82 | v50.4,21.4 50.38,21.42 OR_301.14 | v5,53.8 5,51.4 5.3,51.1 5.3,43.6 v4.7,43
  Top 1.016: U401.27 U401.28 96.13,67.13 97,68 C401.1 | C304.1 9.57,12.47 AND_302.14 | XOR_301.14 4.6,24.59 C301.1 4.6,30.06 C501.1 13.69,35.86 U501.16 | C302.1 26.6,25.25 AND_301.14 | C305.1 38.01,12.31 XOR_302.14 | C303.1 49.6,24.75 OR_301.14 | C603.1 25.6,70.6 U601.8 25.42,70.42 R601.2 | C701.1 46.6,92.19 U701.1 U701.14 | C201.1 34.4,107.54 U201.16 | U203.16 82.4,107.54 C203.1 | U701.14 U701.13 51.5,86.61 51.5,83 53.04,81.46 U701.10 | U202.16 58.89,105.49 C202.1 58.4,104.4 56,102 54,102 51,99 51,94.59 U701.14
  Bottom 0.508: v44.9,97.8 41.3,101.4 v41.3,101.5 | v39.2,103.4 v35.1,103.4 | v48.8,19.82 50.38,21.4 v50.4,21.4 | S904.VCC 3.7,74.24 3.7,68.8 4.23,68.27 S902.VCC | v5,53.8 5.37,53.43 5.37,53.37 5.73,53.01 S907.VCC | S908.VCC 5.73,44.03 v4.7,43
  pour Top: 97,16 96,15 96,11.5 97,10.5 98,10.5 98.5,11 98.5,15 98.5,15.5 98,16
  pour Bottom (rank 2): 0,120 100,120 100,0 0,0

### Text on the board
tNames: MSB | LSB | BAT_LED
bNames: Jakob Soukup 2020